# Altium schematic sheet Hbridge0.SchDoc
size A
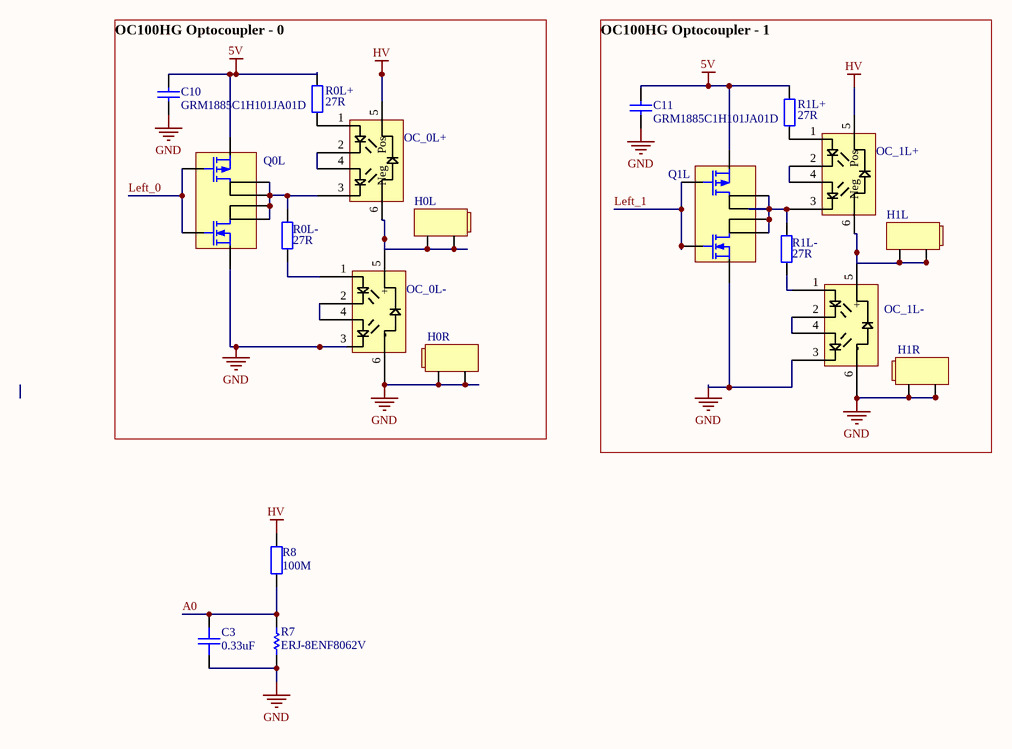
[diagram p0: Hbridge0.SchDoc]

## Parts
C3  value 0.33uF  [1206 CAP]  (hidden comment: Capacitor 0.33uF)
C10  GRM1885C1H101JA01D  [CAPC1608X90X35NL10T15]
C11  GRM1885C1H101JA01D  [CAPC1608X90X35NL10T15]
H0L  HV Socket  [HV Socket 2mm]  (value not drawn)
H0R  HV Socket  [HV Socket 2mm]  (value not drawn)
H1L  HV Socket  [HV Socket 2mm]  (value not drawn)
H1R  HV Socket  [HV Socket 2mm]  (value not drawn)
OC_0L+  OC100HG  [OC100G]  (value not drawn)
OC_0L-  OC100HG  [OC100G]  (value not drawn)
OC_1L+  OC100HG  [OC100G]  (value not drawn)
OC_1L-  OC100HG  [OC100G]  (value not drawn)
Q0L  Dual MOSFET  [SO-8]  (value not drawn)
Q1L  Dual MOSFET  [SO-8]  (value not drawn)
R0L+  value 27R  [1206 R]  (hidden comment: Resistor)
R0L-  value 27R  [1206 R]  (hidden comment: Resistor)
R1L+  value 27R  [1206 R]  (hidden comment: Resistor)
R1L-  value 27R  [1206 R]  (hidden comment: Resistor)
R7  ERJ-8ENF8062V  [RESC3216X70X50LL05T20]
R8  value 100M  [HV resistor]  (hidden comment: Resistor)

## Nets
5V: C10.2 C11.2 Q0L.3 Q1L.3 R0L+.2 R1L+.2
GND: C3.1 C10.1 C11.1 H0R.1 H0R.2 H1R.1 H1R.2 OC_0L-.3(LED_2-) OC_0L-.6(-) OC_1L-.3(LED_2-) OC_1L-.6(-) Q0L.1 Q1L.1 R7.1
HV: OC_0L+.5(Pos) OC_1L+.5(Pos) R8.2
A0: C3.2 R7.2 R8.1
Left_0: Q0L.2 Q0L.4
Left_1: Q1L.2 Q1L.4
NetH0L_1: H0L.1 H0L.2 OC_0L+.6(Neg) OC_0L-.5(+)
NetH1L_1: H1L.1 H1L.2 OC_1L+.6(Neg) OC_1L-.5(+)
NetOC_0L+_1: OC_0L+.1(LED_1+) R0L+.1
NetOC_0L+_2: OC_0L+.2(LED_1-) OC_0L+.4(LED_2+)
NetOC_0L+_3: OC_0L+.3(LED_2-) Q0L.5 Q0L.6 Q0L.7 Q0L.8 R0L-.1
NetOC_0L-_1: OC_0L-.1(LED_1+) R0L-.2
NetOC_0L-_2: OC_0L-.2(LED_1-) OC_0L-.4(LED_2+)
NetOC_1L+_1: OC_1L+.1(LED_1+) R1L+.1
NetOC_1L+_2: OC_1L+.2(LED_1-) OC_1L+.4(LED_2+)
NetOC_1L+_3: OC_1L+.3(LED_2-) Q1L.5 Q1L.6 Q1L.7 Q1L.8 R1L-.1
NetOC_1L-_1: OC_1L-.1(LED_1+) R1L-.2
NetOC_1L-_2: OC_1L-.2(LED_1-) OC_1L-.4(LED_2+)

## Notes on the sheet
- OC100HG Optocoupler - 0
- OC100HG Optocoupler - 1

## Library data of the parts
C3 = Capacitor 0.33uF: ‎399-1285-1-ND‎ Manufacturer: ‎C1206C334K3RACTU‎
C10 C11 = CMP-2006-02595-1: Manufacturer: Murata; Part Number: GRM1885C1H101JA01D
H0L H0R H1L H1R = HV Socket: Black: 486-3654-ND / Red: ‎486-3655-ND‎
R0L+ R0L- R1L+ R1L- = Resistor 27R: Manufacturer ‎HRG3216Q-27R0-D-T1‎ / Digikey ‎408-1908-1-ND
R7 = CMP-2003-00504-1: Manufacturer: Panasonic; Part Number: ERJ-8ENF8062V
R8 = Resistor 100M: Digikey:‎SM102031006FE-ND‎ / Manufacturer: ‎SM102031006FE-ND‎